# Altium schematic sheet Sheet1.SchDoc
size A3
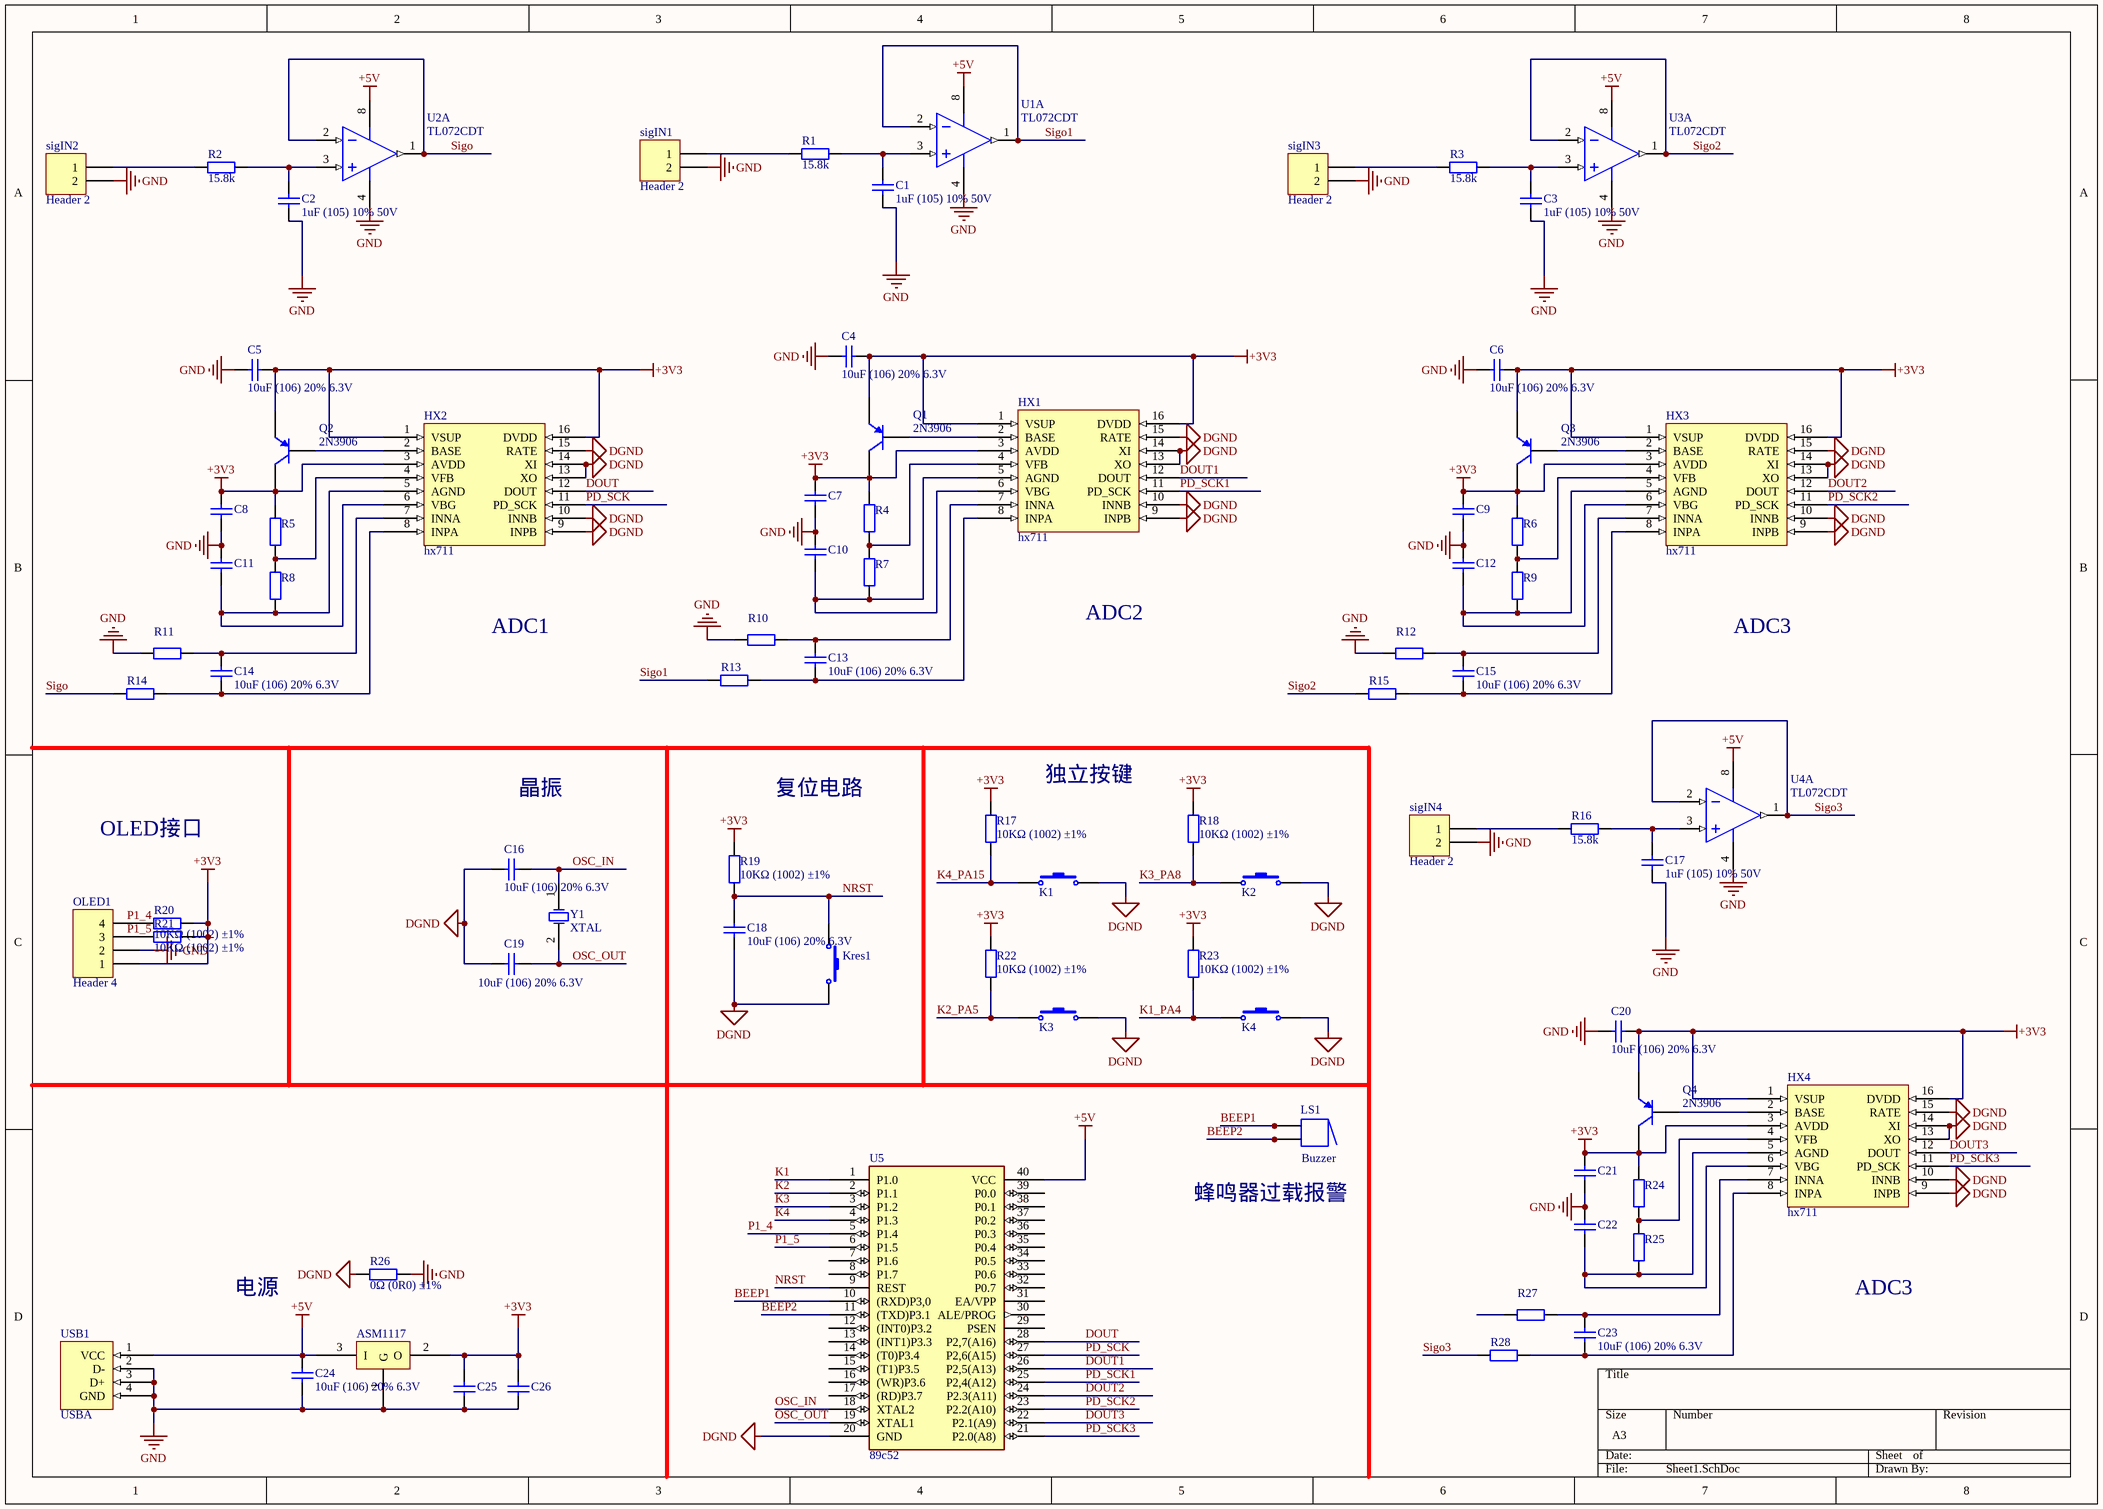
[diagram p0: Sheet1.SchDoc]

## Parts
asm1  ASM1117  [1117PCB]
C1  1uF (105) 10% 50V  [0805_C]
C2  1uF (105) 10% 50V  [0805_C]
C3  1uF (105) 10% 50V  [0805_C]
C4  10uF (106) 20% 6.3V  [0402_C]
C5  10uF (106) 20% 6.3V  [0402_C]
C6  10uF (106) 20% 6.3V  [0402_C]
C7  10uF (106) 20% 6.3V  [0402_C]  (value not drawn)
C8  10uF (106) 20% 6.3V  [0402_C]  (value not drawn)
C9  10uF (106) 20% 6.3V  [0402_C]  (value not drawn)
C10  10uF (106) 20% 6.3V  [0402_C]  (value not drawn)
C11  10uF (106) 20% 6.3V  [0402_C]  (value not drawn)
C12  10uF (106) 20% 6.3V  [0402_C]  (value not drawn)
C13  10uF (106) 20% 6.3V  [0402_C]
C14  10uF (106) 20% 6.3V  [0402_C]
C15  10uF (106) 20% 6.3V  [0402_C]
C16  10uF (106) 20% 6.3V  [0402_C]
C17  1uF (105) 10% 50V  [0805_C]
C18  10uF (106) 20% 6.3V  [0402_C]
C19  10uF (106) 20% 6.3V  [0402_C]
C20  10uF (106) 20% 6.3V  [0402_C]
C21  10uF (106) 20% 6.3V  [0402_C]  (value not drawn)
C22  10uF (106) 20% 6.3V  [0402_C]  (value not drawn)
C23  10uF (106) 20% 6.3V  [0402_C]
C24  10uF (106) 20% 6.3V  [0402_C]
C25  10uF (106) 20% 6.3V  [0402_C]  (value not drawn)
C26  10uF (106) 20% 6.3V  [0402_C]  (value not drawn)
HX1  hx711  [HX711]
HX2  hx711  [HX711]
HX3  hx711  [HX711]
HX4  hx711  [HX711]
K1  key  [KEYPCB]  (value not drawn)
K2  key  [KEYPCB]  (value not drawn)
K3  key  [KEYPCB]  (value not drawn)
K4  key  [KEYPCB]  (value not drawn)
Kres1  key  [KEYPCB]  (value not drawn)
LS1  Buzzer  [ABSM-1574]
OLED1  Header 4  [HDR1X4]
Q1  2N3906  [TO-92A]
Q2  2N3906  [TO-92A]
Q3  2N3906  [TO-92A]
Q4  2N3906  [TO-92A]
R1  15.8k  [0805_R]
R2  15.8k  [0805_R]
R3  15.8k  [0805_R]
R4  10KΩ (1002) ±1%  [0603_R]  (value not drawn)
R5  10KΩ (1002) ±1%  [0603_R]  (value not drawn)
R6  10KΩ (1002) ±1%  [0603_R]  (value not drawn)
R7  10KΩ (1002) ±1%  [0603_R]  (value not drawn)
R8  10KΩ (1002) ±1%  [0603_R]  (value not drawn)
R9  10KΩ (1002) ±1%  [0603_R]  (value not drawn)
R10  1KΩ (1002) ±1%  [0603_R]  (value not drawn)
R11  1KΩ (1002) ±1%  [0603_R]  (value not drawn)
R12  1KΩ (1002) ±1%  [0603_R]  (value not drawn)
R13  1KΩ (1002) ±1%  [0603_R]  (value not drawn)
R14  1KΩ (1002) ±1%  [0603_R]  (value not drawn)
R15  1KΩ (1002) ±1%  [0603_R]  (value not drawn)
R16  15.8k  [0805_R]
R17  10KΩ (1002) ±1%  [0603_R]
R18  10KΩ (1002) ±1%  [0603_R]
R19  10KΩ (1002) ±1%  [0603_R]
R20  10KΩ (1002) ±1%  [0603_R]
R21  10KΩ (1002) ±1%  [0603_R]
R22  10KΩ (1002) ±1%  [0603_R]
R23  10KΩ (1002) ±1%  [0603_R]
R24  10KΩ (1002) ±1%  [0603_R]  (value not drawn)
R25  10KΩ (1002) ±1%  [0603_R]  (value not drawn)
R26  0Ω (0R0) ±1%  [0603_R]
R27  1KΩ (1002) ±1%  [0603_R]  (value not drawn)
R28  1KΩ (1002) ±1%  [0603_R]  (value not drawn)
sigIN1  Header 2  [HDR1X2]
sigIN2  Header 2  [HDR1X2]
sigIN3  Header 2  [HDR1X2]
sigIN4  Header 2  [HDR1X2]
U1  TL072CDT  [SOIC-8_150mil]  (part A of 2)
U2  TL072CDT  [SOIC-8_150mil]  (part A of 2)
U3  TL072CDT  [SOIC-8_150mil]  (part A of 2)
U4  TL072CDT  [SOIC-8_150mil]  (part A of 2)
U5  89c52  [DIP40]
USB1  USBA  [USB-A]
Y1  XTAL  [R38]

## Nets
+3V3: asm1.2(O) C4.2 C5.2 C6.2 C7.1 C8.1 C9.1 C20.2 C21.1 C25.1 C26.1 HX1.1(VSUP) HX1.3(AVDD) HX1.16(DVDD) HX2.1(VSUP) HX2.3(AVDD) HX2.16(DVDD) HX3.1(VSUP) HX3.3(AVDD) HX3.16(DVDD) HX4.1(VSUP) HX4.3(AVDD) HX4.16(DVDD) OLED1.1 Q1.1(E) Q1.3(C) Q2.1(E) Q2.3(C) Q3.1(E) Q3.3(C) Q4.1(E) Q4.3(C) R4.2 R5.2 R6.2 R17.2 R18.2 R19.2 R20.1 R21.1 R22.2 R23.2 R24.2
+5V: asm1.3(I) C24.1 U1.8(V+) U2.8(V+) U3.8(V+) U4.8(V+) U5.40(VCC) USB1.1(VCC)
DGND: C16.2 C18.1 C19.2 HX1.9(INPB) HX1.10(INNB) HX1.13(XO) HX1.14(XI) HX1.15(RATE) HX2.9(INPB) HX2.10(INNB) HX2.13(XO) HX2.14(XI) HX2.15(RATE) HX3.9(INPB) HX3.10(INNB) HX3.13(XO) HX3.14(XI) HX3.15(RATE) HX4.9(INPB) HX4.10(INNB) HX4.13(XO) HX4.14(XI) HX4.15(RATE) K1.2 K2.2 K3.2 K4.2 Kres1.2 R26.1 U5.20(GND)
GND: asm1.1(G) C1.1 C2.1 C3.1 C4.1 C5.1 C6.1 C7.2 C8.2 C9.2 C10.1 C11.1 C12.1 C17.1 C20.1 C21.2 C22.1 C24.2 C25.2 C26.2 OLED1.2 R10.2 R11.2 R12.2 R26.2 sigIN1.2 sigIN2.2 sigIN3.2 sigIN4.2 U1.4(V-) U2.4(V-) U3.4(V-) U4.4(V-) USB1.2(D-) USB1.3(D+) USB1.4(GND)
BEEP1: LS1.1 LS1.1A U5.10((RXD)P3,0)
BEEP2: LS1.2 LS1.2A U5.11((TXD)P3.1)
DOUT: HX2.12(DOUT) U5.28(P2,7(A16))
DOUT1: HX1.12(DOUT) U5.26(P2,5(A13))
DOUT2: HX3.12(DOUT) U5.24(P2.3(A11))
DOUT3: HX4.12(DOUT) U5.22(P2.1(A9))
K1: U5.1(P1.0)
K1_PA4: K4.1 R23.1
K2: U5.2(P1.1)
K2_PA5: K3.1 R22.1
K3: U5.3(P1.2)
K3_PA8: K2.1 R18.1
K4: U5.4(P1.3)
K4_PA15: K1.1 R17.1
NRST: C18.2 Kres1.1 R19.1 U5.9(REST)
OSC_IN: C16.1 U5.18(XTAL2) Y1.1(OSC1)
OSC_OUT: C19.1 U5.19(XTAL1) Y1.2(OSC2)
P1_4: U5.5(P1.4)
P1_5: U5.6(P1.5)
PD_SCK: HX2.11(PD_SCK) U5.27(P2,6(A15))
PD_SCK1: HX1.11(PD_SCK) U5.25(P2,4(A12))
PD_SCK2: HX3.11(PD_SCK) U5.23(P2.2(A10))
PD_SCK3: HX4.11(PD_SCK) U5.21(P2.0(A8))
Sigo: R14.2 U2.1(OUT) U2.2(IN-)
Sigo1: R13.2 U1.1(OUT) U1.2(IN-)
Sigo2: R15.2 U3.1(OUT) U3.2(IN-)
Sigo3: R28.2 U4.1(OUT) U4.2(IN-)
NetC1_2: C1.2 R1.2 U1.3(IN+)
NetC2_2: C2.2 R2.2 U2.3(IN+)
NetC3_2: C3.2 R3.2 U3.3(IN+)
NetC10_2: C10.2 HX1.5(AGND) HX1.6(VBG) R7.1
NetC11_2: C11.2 HX2.5(AGND) HX2.6(VBG) R8.1
NetC12_2: C12.2 HX3.5(AGND) HX3.6(VBG) R9.1
NetC13_1: C13.1 HX1.7(INNA) R10.1
NetC13_2: C13.2 HX1.8(INPA) R13.1
NetC14_1: C14.1 HX2.7(INNA) R11.1
NetC14_2: C14.2 HX2.8(INPA) R14.1
NetC15_1: C15.1 HX3.7(INNA) R12.1
NetC15_2: C15.2 HX3.8(INPA) R15.1
NetC17_2: C17.2 R16.2 U4.3(IN+)
NetC22_2: C22.2 HX4.5(AGND) HX4.6(VBG) R25.1
NetC23_1: C23.1 HX4.7(INNA) R27.1
NetC23_2: C23.2 HX4.8(INPA) R28.1
NetHX1_2: HX1.2(BASE) Q1.2(B)
NetHX1_4: HX1.4(VFB) R4.1 R7.2
NetHX2_2: HX2.2(BASE) Q2.2(B)
NetHX2_4: HX2.4(VFB) R5.1 R8.2
NetHX3_2: HX3.2(BASE) Q3.2(B)
NetHX3_4: HX3.4(VFB) R6.1 R9.2
NetHX4_2: HX4.2(BASE) Q4.2(B)
NetHX4_4: HX4.4(VFB) R24.1 R25.2
NetOLED1_3: OLED1.3 R21.2
NetOLED1_4: OLED1.4 R20.2
NetR1_1: R1.1 sigIN1.1
NetR2_1: R2.1 sigIN2.1
NetR3_1: R3.1 sigIN3.1
NetR16_1: R16.1 sigIN4.1

Not connected (* = marked no-connect by the designer): R27 2; U5 7(P1.6) 8(P1.7) 12((INT0)P3.2) 13((INT1)P3.3) 14((T0)P3.4) 15((T1)P3.5) 16((WR)P3.6) 17((RD)P3.7) 29(PSEN) 30(ALE/PROG) 31(EA/VPP) 32(P0.7) 33(P0.6) 34(P0.5) 35(P0.4) 36(P0.3) 37(P0.2) 38(P0.1) 39(P0.0)

## Notes on the sheet
- ADC1
- ADC2
- ADC3
- 独立按键
- OLED接口
- 晶振
- 复位电路
- (near LS1) 蜂鸣器过载报警
- 电源
- Labels drawn without touching a wire or pin: P1_4, P1_5

## Library data of the parts
asm1 = 1117
C1-C3 C17 = 0805 1uF (105) 10% 50V: 贴片电容; ComponentLink1Description: 供应商链接; ComponentLink1URL: http://www.szlcsc.com/product/details_29074.html; Package: 0805; Supplier: LC; SuppliersPartNumber: C28323
C4-C16 C18-C26 = 0402 10uF (106) 20% 6.3V: 贴片电容; ComponentLink1Description: 供应商链接; ComponentLink1URL: http://www.szlcsc.com/product/details_16204.html; Package: 0402; Supplier: LC; SuppliersPartNumber: C15525
LS1 = Buzzer: Magnetic Transducer Buzzer; Published: 24-Mar-1999; LatestRevisionDate: 17-Dec-2003; LatestRevisionNote: Schematic revised, PCB Footprint replaced.; DatasheetVersion: 17-Dec-2003; PackageReference: ABSM-1574; Publisher: Altium Limited; PackageDescription: Magnetic Transducer Buzzer; ComponentLink1Description: Manufacturer Link; ComponentLink1URL: http://www.megastar.com/linecard/buzzmode/index.php
OLED1 = Header 4: Header, 4-Pin; LatestRevisionDate: 17-Jul-2002; LatestRevisionNote: Re-released for DXP Platform.; Publisher: Altium Limited
Q1-Q4 = 2N3906: PNP General Purpose Amplifier; Published: 8-Jun-2000; LatestRevisionDate: 15-Jan-2003; LatestRevisionNote: PCB Footprint 'BCY-W3/D4.7' replaced; DatasheetVersion: 1997; PackageVersion: Sep-1998; PackageReference: TO-92A; Publisher: Altium Limited; PackageDescription: TO, Flat Index; 3 In-Line, Axial Leads; Body Dia. 4.5mm; Leads 0.51 x 0.48 mm (max); ComponentLink1Description: Manufacturer Link; ComponentLink1URL: http://www.fairchildsemi.com/; ComponentLink2Description: Datasheet; ComponentLink2URL: http://www.fairchildsemi.com/ds/2N%2F2N3906.pdf
R1-R3 R16 = 0805 330KΩ (3303) 1%: 贴片电阻; ComponentLink1Description: 供应商链接; ComponentLink1URL: http://www.szlcsc.com/product/details_18317.html; Package: 0805; Supplier: LC; SuppliersPartNumber: C17629
R4-R15 R17-R25 R27 R28 = 0603 10KΩ (1002) 1%: 贴片电阻; ComponentLink1Description: 供应商链接; ComponentLink1URL: http://www.szlcsc.com/product/details_26547.html; Package: 0603; Supplier: LC; SuppliersPartNumber: C25804
R26 = 0603 0Ω (0R0) 1%: 贴片电阻; ComponentLink1Description: 供应商链接; ComponentLink1URL: http://www.szlcsc.com/product/details_21903.html; Package: 0603; Supplier: LC; SuppliersPartNumber: C21189
sigIN1-sigIN4 = Header 2: Header, 2-Pin; LatestRevisionDate: 17-Jul-2002; LatestRevisionNote: Re-released for DXP Platform.; Publisher: Altium Limited
U1-U4 = TL072CDT_[C6961]: 运放; ComponentLink1Description: 供应商链接; ComponentLink1URL: http://www.szlcsc.com/product/details_7433.html; Package: SOIC-8_150mil; Supplier: LC; SuppliersPartNumber: C6961
U5 = 89c52: AT89C52
Y1 = XTAL: Crystal Oscillator; Published: 8-Jun-2000; LatestRevisionDate: 17-Jul-2002; LatestRevisionNote: Re-released for DXP Platform.; PackageReference: R38; Publisher: Altium Limited; PackageDescription: Crystal, Thru-Hole; 2 Leads; Body 3.1 x 8.2 mm (Dia.xH)